# EAGLE schematic Tesseract_STEPPER (EAGLE 7.7.0)
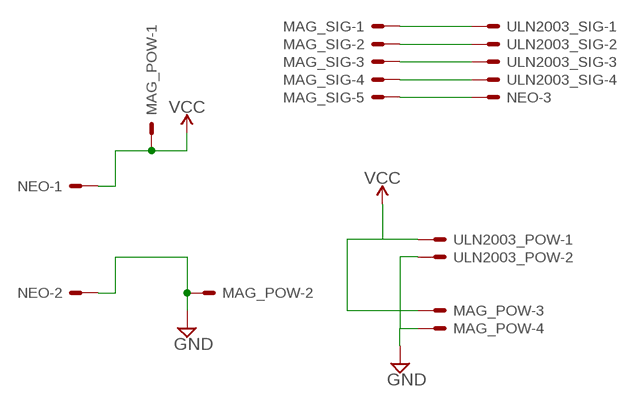
[diagram p0: schematic, sheet 1]

## Parts
MAG_POW  JST-XH-04-PIN-LONG-PAD  [JST-XH-04-PACKAGE-LONG-PAD]
MAG_SIG  JST-XH-05-PIN-LONG-PAD  [JST-XH-05-PACKAGE-LONG-PAD]
NEO  JST-XH-03-PIN-LONG-PAD  [JST-XH-03-PACKAGE-LONG-PAD]
ULN2003_POW  JST-XH-02-PIN-LONG-PAD  [JST-XH-02-PACKAGE-LONG-PAD]
ULN2003_SIG  JST-XH-04-PIN-LONG-PAD  [JST-XH-04-PACKAGE-LONG-PAD]

## Nets
5V_GND: MAG_POW.2 NEO.2 ; supply symbol labelled GND
5V_VCC: MAG_POW.1 NEO.1 ; supply symbol labelled VCC
12V_GND: MAG_POW.4 ULN2003_POW.2 ; supply symbol labelled GND
12V_VCC: MAG_POW.3 ULN2003_POW.1 ; supply symbol labelled VCC
PIN3: MAG_SIG.1 ULN2003_SIG.1
PIN4: MAG_SIG.2 ULN2003_SIG.2
PIN5: MAG_SIG.3 ULN2003_SIG.3
PIN6: MAG_SIG.4 ULN2003_SIG.4
PIN7: MAG_SIG.5 NEO.3

## Library data of the parts
MAG_POW ULN2003_SIG = Rembrandt Electronics - JST XH Connectors v1-0:JST-XH-04-PIN: JST XH Connector 2 Pin Wire to board connector. Pitch: 2,54 mm, (0.100") Number of pins: 4 Created by Rembrandt Electronics www.rembrandtelectronics.com
MAG_SIG = Rembrandt Electronics - JST XH Connectors v1-0:JST-XH-05-PIN: JST XH Connector 2 Pin Wire to board connector. Pitch: 2,54 mm, (0.100") Number of pins: 5 Created by Rembrandt Electronics www.rembrandtelectronics.com
NEO = Rembrandt Electronics - JST XH Connectors v1-0:JST-XH-03-PIN: JST XH Connector 2 Pin Wire to board connector. Pitch: 2,54 mm, (0.100") Number of pins: 3 Created by Rembrandt Electronics www.rembrandtelectronics.com
ULN2003_POW = Rembrandt Electronics - JST XH Connectors v1-0:JST-XH-02-PIN: JST XH Connector 2 Pin Wire to board connector. Pitch: 2,54 mm, (0.100") Number of pins: 2 Created by Rembrandt Electronics www.rembrandtelectronics.com